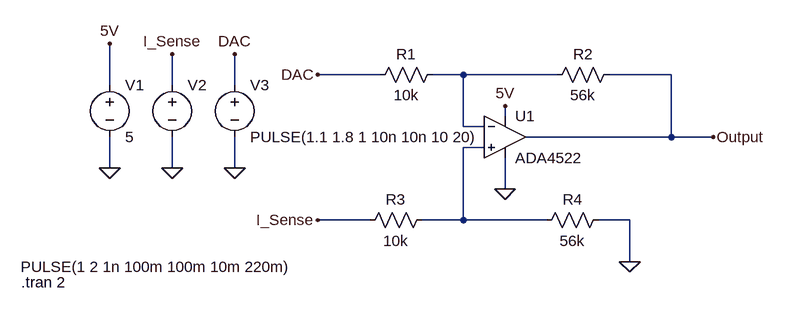
[diagram p0: schematic Draft6.asc]
Draft6.asc, the LTspice schematic file:
Version 4.1
SHEET 1 880 680
WIRE 0 48 -96 48
WIRE 128 48 80 48
WIRE 272 48 128 48
WIRE 448 48 352 48
WIRE -416 64 -416 0
WIRE -320 64 -320 16
WIRE -224 64 -224 16
WIRE 192 112 192 96
WIRE 128 128 128 48
WIRE 160 128 128 128
WIRE 448 144 448 48
WIRE 448 144 224 144
WIRE 512 144 448 144
WIRE 160 160 128 160
WIRE -416 192 -416 144
WIRE -320 192 -320 144
WIRE -224 192 -224 144
WIRE 192 224 192 176
WIRE -16 272 -96 272
WIRE 128 272 128 160
WIRE 128 272 64 272
WIRE 256 272 128 272
WIRE 384 272 336 272
WIRE 384 336 384 272
FLAG 192 224 0
FLAG 192 96 5V
FLAG 384 336 0
FLAG 512 144 Output
FLAG -96 48 DAC
FLAG -96 272 I_Sense
FLAG -416 192 0
FLAG -320 192 0
FLAG -224 192 0
FLAG -224 16 DAC
FLAG -320 16 I_Sense
FLAG -416 0 5V
SYMBOL lib\\lib\\sym\\ZZZ\\OpAmps\\ADA4522 192 80 R0
SYMATTR InstName U1
SYMBOL res 96 32 R90
WINDOW 0 0 56 VBottom 2
WINDOW 3 32 56 VTop 2
SYMATTR InstName R1
SYMATTR Value 10k
SYMBOL res 368 32 R90
WINDOW 0 0 56 VBottom 2
WINDOW 3 32 56 VTop 2
SYMATTR InstName R2
SYMATTR Value 56k
SYMBOL res 80 256 R90
WINDOW 0 0 56 VBottom 2
WINDOW 3 32 56 VTop 2
SYMATTR InstName R3
SYMATTR Value 10k
SYMBOL res 352 256 R90
WINDOW 0 0 56 VBottom 2
WINDOW 3 32 56 VTop 2
SYMATTR InstName R4
SYMATTR Value 56k
SYMBOL voltage -416 48 R0
WINDOW 123 0 0 Left 0
WINDOW 39 0 0 Left 0
SYMATTR InstName V1
SYMATTR Value 5
SYMBOL voltage -320 48 R0
WINDOW 3 -233 296 Left 2
WINDOW 123 0 0 Left 0
WINDOW 39 0 0 Left 0
SYMATTR InstName V2
SYMATTR Value PULSE(1 2 1n 100m 100m 10m 220m)
SYMBOL voltage -224 48 R0
WINDOW 123 0 0 Left 0
WINDOW 39 0 0 Left 0
SYMATTR InstName V3
SYMATTR Value PULSE(1.1 1.8 1 10n 10n 10 20)
TEXT -552 368 Left 2 !.tran 2

The netlist it stands for:
* Draft6.asc
* U1: ADA4522 (symbol lib\lib\sym\ZZZ\OpAmps\ADA4522 not available, pins judged from their places): In+=N002 In-=N001 V+=5V V-=0 OUT=Output
R1 N001 DAC 10k
R2 Output N001 56k
R3 N002 I_Sense 10k
R4 0 N002 56k
V1 5V 0 5
V2 I_Sense 0 PULSE(1 2 1n 100m 100m 10m 220m)
V3 DAC 0 PULSE(1.1 1.8 1 10n 10n 10 20)
.tran 2
.backanno
.end